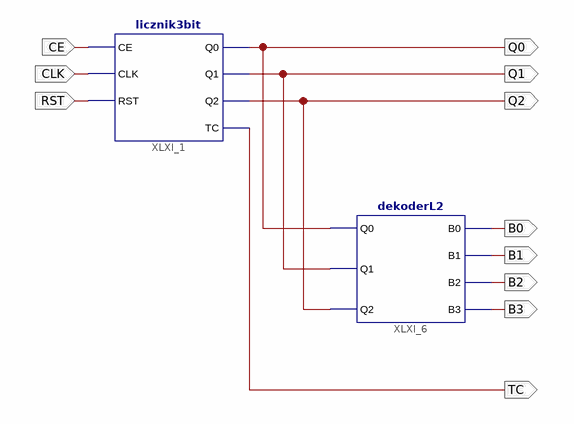
[diagram p0: schematic sheet 1]
// Xilinx ISE schematic licznikL2.sch (spartan3e) as structural Verilog: 2 symbols, 11 ports
module licznikL2 (
  input  CE,
  input  CLK,
  input  RST,
  output B1,
  output B0,
  output B2,
  output B3,
  output Q2,
  output Q1,
  output Q0,
  output TC
);

  licznik3bit XLXI_1 (.RST(RST), .CLK(CLK), .CE(CE), .Q0(Q0), .Q1(Q1), .Q2(Q2), .TC(TC));
  dekoderL2 XLXI_6 (.Q0(Q0), .Q1(Q1), .Q2(Q2), .B3(B3), .B0(B0), .B2(B2), .B1(B1));
endmodule
